# EAGLE schematic trabalho_tri_2 (EAGLE 6.6.0)
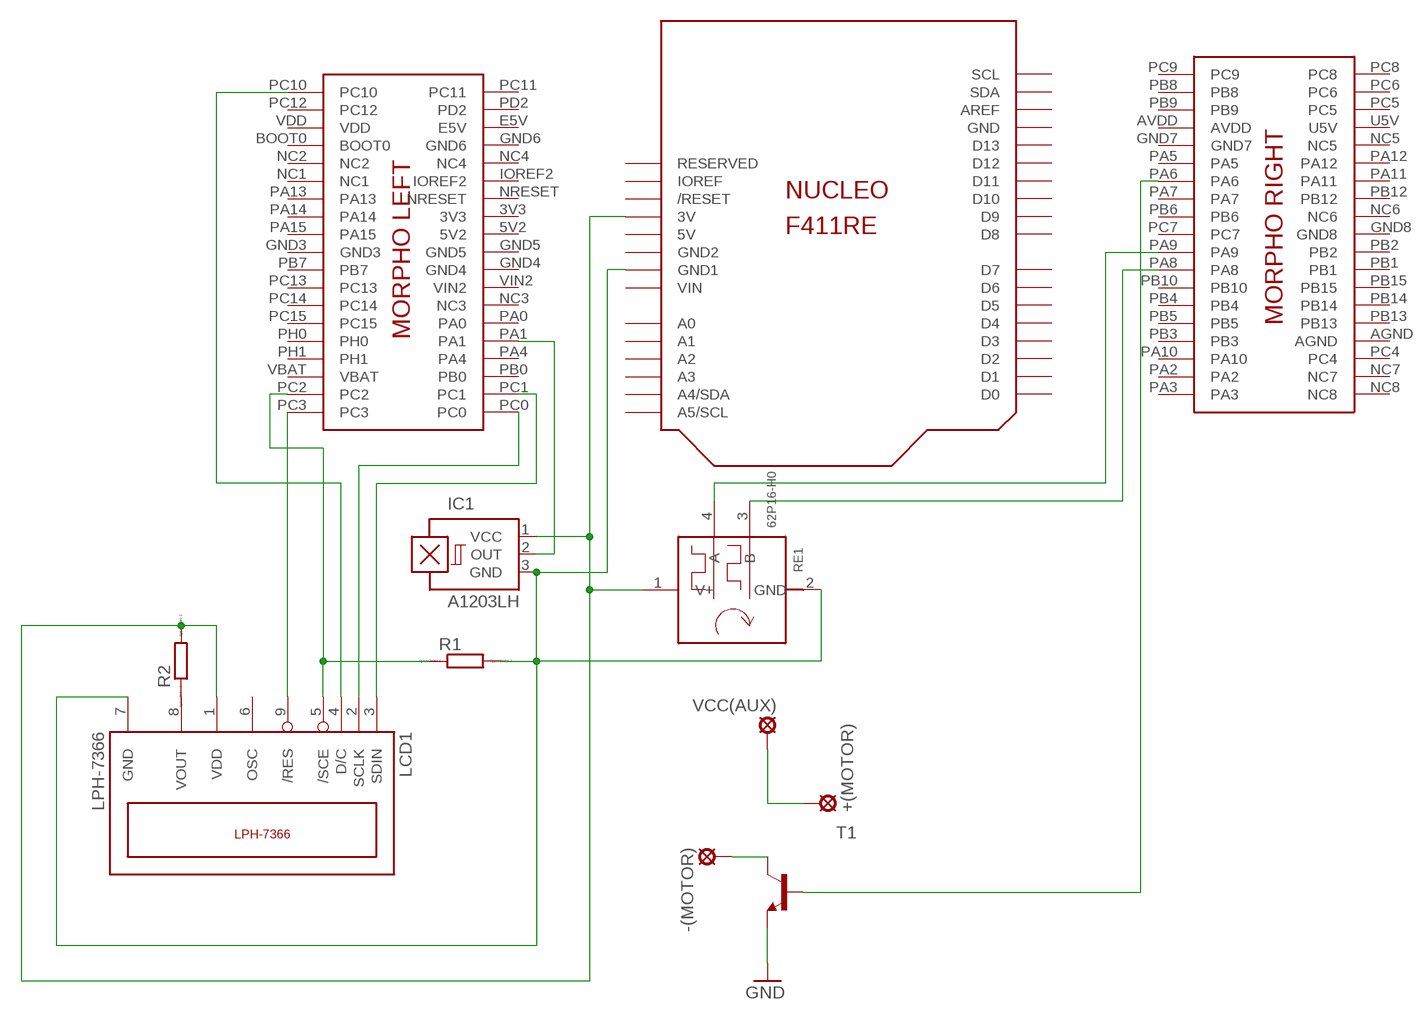
[diagram p0: schematic, sheet 1]

## Parts
+(MOTOR)  SE11  [SE11]
-(MOTOR)  SE11  [SE11]
IC1  A1203LH  [SOT23-W]
LCD1  LPH-7366  [LPH-7366]
R1  R0204/7  [0204/7]
R2  R0204/7  [0204/7]
RE1  62P16-H0  [62P]
T1  -NPN-SOT93V  [SOT93V]
U$1  NUCLEO_F411RE  [NUCLEO_BRD64]
VCC(AUX)  SE11  [SE11]

## Nets
GND: IC1.3(GND) LCD1.7(GND) R1.2 RE1.2(GND) T1.E U$1.GND1
N$1: -(MOTOR).MP T1.C
N$2: +(MOTOR).MP VCC(AUX).MP
N$3: RE1.4(A) U$1.PA9
N$4: RE1.3(B) U$1.PA8
N$5: T1.B U$1.PA6
N$6: IC1.2(OUT) U$1.PA1
N$7: LCD1.5(/SCE) R1.1 U$1.PC2
N$8: LCD1.2(SCLK) U$1.PC0
N$9: LCD1.9(/RES) U$1.PC3
N$10: LCD1.3(SDIN) U$1.PC1
N$11: LCD1.4(D/C) U$1.PC10
N$12: LCD1.8(VOUT) R2.1
V+: IC1.1(VCC) LCD1.1(VDD) R2.2 RE1.1(V+) U$1.3V
Unconnected: LCD1.6(OSC) U$1.A0 U$1.A1 U$1.A2 U$1.A3 U$1.A4(A4/SDA) U$1.A5(A5/SCL) U$1.AREF U$1.BOOT0 U$1.D0 U$1.D1 U$1.D2 U$1.D3 U$1.D4 U$1.D5 U$1.D6 U$1.D7 U$1.D8 U$1.D9 U$1.D10 U$1.D11 U$1.D12 U$1.D13 U$1.IOREF U$1.IOREF2 U$1.NC1 U$1.NC2 U$1.NC3 U$1.NC4 U$1.NC5 U$1.NC6 U$1.NC7 U$1.NC8 U$1.NRESET U$1.PA0 U$1.PA2 U$1.PA3 U$1.PA4 U$1.PA5 U$1.PA7 U$1.PA10 U$1.PA11 U$1.PA12 U$1.PA13 U$1.PA14 U$1.PA15 U$1.PB0 U$1.PB1 U$1.PB2 U$1.PB3 U$1.PB4 U$1.PB5 U$1.PB6 U$1.PB7 U$1.PB8 U$1.PB9 U$1.PB10 U$1.PB12 U$1.PB13 U$1.PB14 U$1.PB15 U$1.PC4 U$1.PC5 U$1.PC6 U$1.PC7 U$1.PC8 U$1.PC9 U$1.PC11 U$1.PC12 U$1.PC13 U$1.PC14 U$1.PC15 U$1.PD2 U$1.PH0 U$1.PH1 U$1.RESERVED U$1.RESET(/RESET) U$1.SCL U$1.SDA

## Power pins joined to a net without a drawn wire
3V3: U$1.3V3
5V: U$1.5V
5V2: U$1.5V2
AGND: U$1.AGND
AVDD: U$1.AVDD
E5V: U$1.E5V
GND: U$1.GND
GND2: U$1.GND2
GND3: U$1.GND3
GND4: U$1.GND4
GND5: U$1.GND5
GND6: U$1.GND6
GND7: U$1.GND7
GND8: U$1.GND8
U5V: U$1.U5V
VBAT: U$1.VBAT
VDD: U$1.VDD
VIN: U$1.VIN
VIN2: U$1.VIN2

## Library data of the parts
+(MOTOR) -(MOTOR) VCC(AUX) = solpad:SE11: SOLDER PAD RTM, drill 1,1mm, distributor Buerklin, 07F810
IC1 = allegro:A12*?: Hall-effect bipolar switch Source: http://www.allegromicro.com/en/Products/Part_Numbers/1202/1202.pdf; MF: ALLEGRO MICROSYSTEMS, INC.; MPN: A1203LLHLT-T; OC_FARNELL: 1791384; OC_NEWARK: 31K6608
LCD1 = lph-7366:LPH-7366
R1 R2 = eagle-ltspice:R: RESISTOR, European symbol; SPICEMODEL: NONE; SPICEPREFIX: R
RE1 = rotary-encoder:62P*0
T1 = transistor:*-NPN-: NPN Transistror BF959 corrected 2008.03.06
U$1 = Stm32nucleo:NUCLEO_F411RE